# Altium schematic sheet Charger.SchDoc
size A4
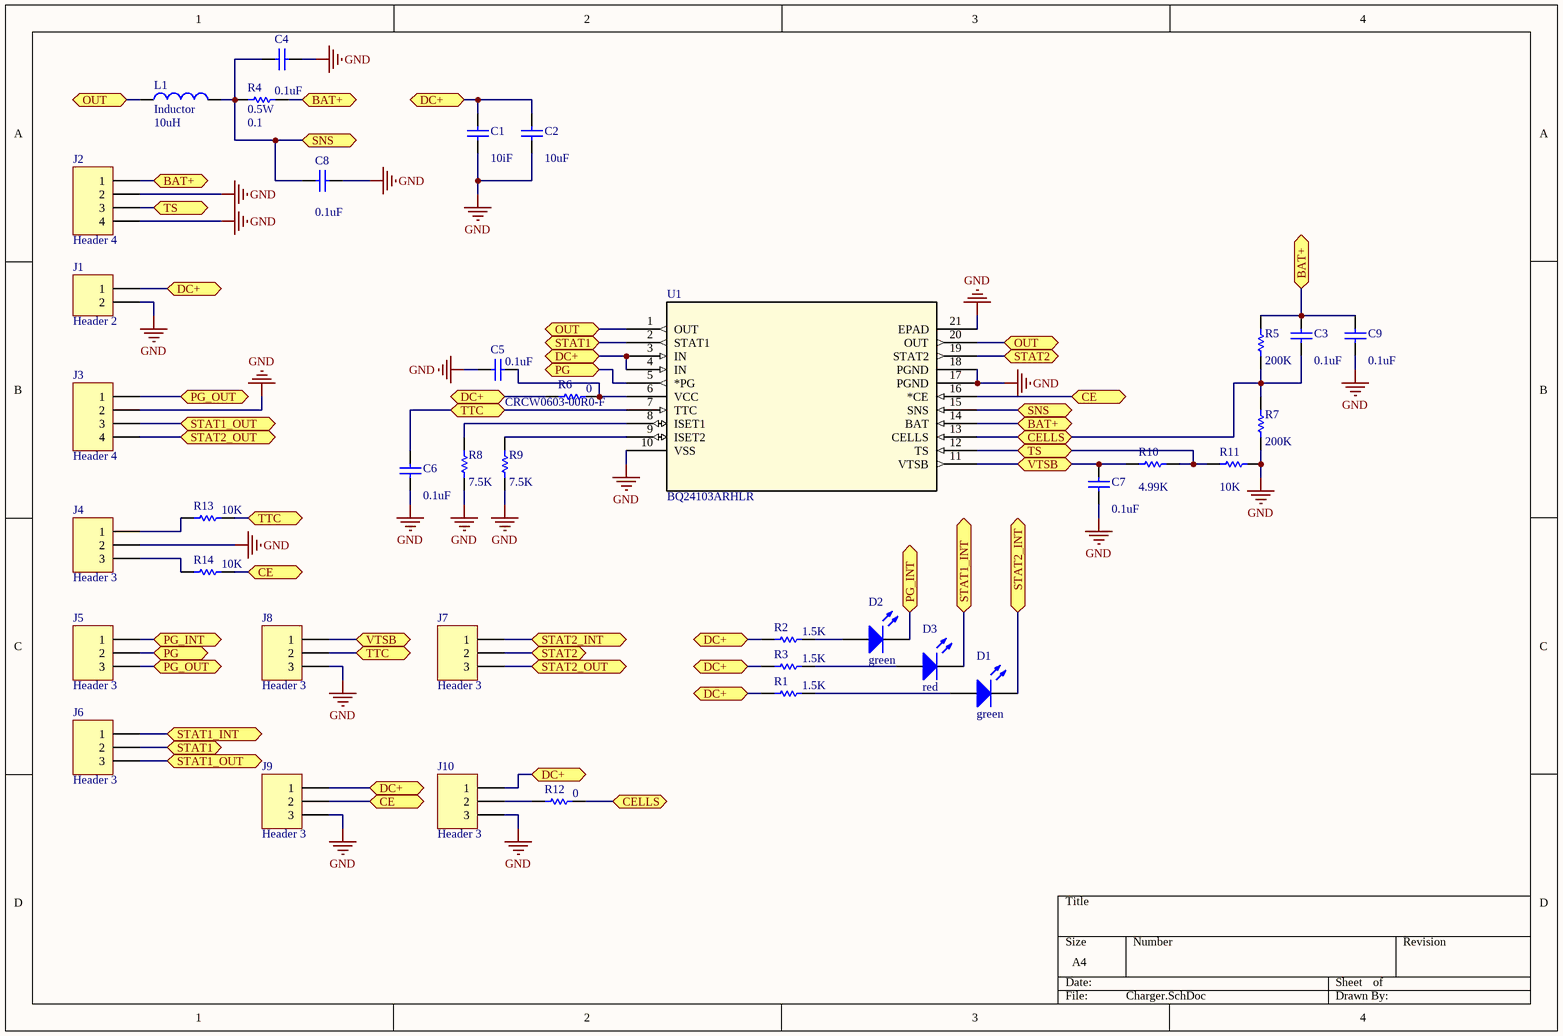
[diagram p0: Charger.SchDoc]

## Parts
C1  value 10iF  [CAPC3216L]
C2  value 10uF  [CAPC3216L]
C3  value 0.1uF  [6-0805_L]
C4  value 0.1uF  [CAPC3216L]
C5  value 0.1uF  [6-0805_L]
C6  value 0.1uF  [6-0805_L]
C7  value 0.1uF  [6-0805_L]
C8  value 0.1uF  [6-0805_L]
C9  value 0.1uF  [CAPC3216L]
D1  green  [6-0805_L]
D2  green  [6-0805_L]
D3  red  [6-0805_L]
J1  Header 2  [691305130002]
J2  Header 4  [691305130004]
J3  Header 4  [691305130004]
J4  Header 3  [691305130003]
J5  Header 3  [HDR1X3]
J6  Header 3  [HDR1X3]
J7  Header 3  [HDR1X3]
J8  Header 3  [HDR1X3]
J9  Header 3  [HDR1X3]
J10  Header 3  [HDR1X3]
L1  Inductor  value 10uH  [IND2926]
R1  value 1.5K  [6-0805_L]
R2  value 1.5K  [6-0805_L]
R3  value 1.5K  [6-0805_L]
R4  0.5W  value 0.1  [12Z-2010]
R5  value 200K  [6-0805_L]
R6  CRCW0603-00R0-F  value 0  [6-0805_L]
R7  value 200K  [6-0805_L]
R8  value 7.5K  [6-0805_L]
R9  value 7.5K  [6-0805_L]
R10  value 4.99K  [6-0805_L]
R11  value 10K  [6-0805_L]
R12  value 0  [6-0805_L]
R13  value 10K  [6-0805_L]
R14  value 10K  [6-0805_L]
U1  BQ24103ARHLR  [RHL20_2P05X3P05]

## Ports
BAT+, CE, CELLS, DC+, OUT, PG, PG_INT, PG_OUT, SNS, STAT1, STAT1_INT, STAT1_OUT, STAT2, STAT2_INT, STAT2_OUT, TS, TTC, VTSB

## Nets
GND: C1.1 C2.1 C4.2 C5.2 C6.2 C7.2 C8.2 C9.2 J1.2 J2.2 J2.4 J3.2 J4.2 J8.3 J9.3 J10.3 R7.2 R8.1 R9.1 R11.1 U1.10(VSS) U1.17(PGND) U1.18(PGND) U1.21(EPAD)
BAT+: C3.1 C9.1 J2.1 R4.2 R5.1 U1.14(BAT) ; port BAT+
CE: J9.2 R14.2 U1.16(*CE) ; port CE
CELLS: C3.2 R5.2 R7.1 R12.2 U1.13(CELLS) ; port CELLS
DC+: C1.2 C2.2 J1.1 J9.1 J10.1 R1.1 R2.1 R3.1 R6.1 U1.3(IN) U1.4(IN) ; port DC+
OUT: L1.1 U1.1(OUT) U1.20(OUT) ; port OUT
PG: J5.2 U1.5(*PG) ; port PG
PG_INT: D2.2(K) J5.1 ; port PG_INT
PG_OUT: J3.1 J5.3 ; port PG_OUT
SNS: C4.1 C8.1 L1.2 R4.1 U1.15(SNS) ; port SNS
STAT1: J6.2 U1.2(STAT1) ; port STAT1
STAT1_INT: D3.2(K) J6.1 ; port STAT1_INT
STAT1_OUT: J3.3 J6.3 ; port STAT1_OUT
STAT2: J7.2 U1.19(STAT2) ; port STAT2
STAT2_INT: D1.2(K) J7.1 ; port STAT2_INT
STAT2_OUT: J3.4 J7.3 ; port STAT2_OUT
TS: J2.3 R10.1 R11.2 U1.12(TS) ; port TS
TTC: C6.1 J8.2 R13.2 U1.7(TTC) ; port TTC
VTSB: C7.1 J8.1 R10.2 U1.11(VTSB) ; port VTSB
NetC5_1: C5.1 R6.2 U1.6(VCC)
NetD1_1: D1.1(A) R1.2
NetD2_1: D2.1(A) R2.2
NetD3_1: D3.1(A) R3.2
NetJ4_1: J4.1 R13.1
NetJ4_3: J4.3 R14.1
NetJ10_2: J10.2 R12.1
NetR8_2: R8.2 U1.8(ISET1)
NetR9_2: R9.2 U1.9(ISET2)

## Library data of the parts
C1-C9 = Cap: Capacitor; Published: 8-Jun-2000; LatestRevisionDate: 17-Jul-2002; LatestRevisionNote: Re-released for DXP Platform.; Publisher: Altium Limited; PackageDescription: Radial Cap, Thru-Hole; 2 Leads; 0.3 in Pin Spacing
  C1 C2 C4 C9: PackageReference: CAPC3216L
  C3 C5-C8: PackageReference: 0603
D1-D3 = LED2: Typical RED, GREEN, YELLOW, AMBER GaAs LED; Published: 8-Jun-2000; LatestRevisionDate: 17-Jul-2002; LatestRevisionNote: Re-released for DXP Platform.; PackageVersion: Feb-2002; PackageReference: 0603; Publisher: Altium Limited; PackageDescription: SM LED; 2 Flat Leads
J1 = Header 2: Header, 2-Pin; LatestRevisionDate: 17-Jul-2002; LatestRevisionNote: Re-released for DXP Platform.; Publisher: Altium Limited
J2 J3 = Header 4: Header, 4-Pin; LatestRevisionDate: 17-Jul-2002; LatestRevisionNote: Re-released for DXP Platform.; Publisher: Altium Limited
J4-J10 = Header 3: Header, 3-Pin; LatestRevisionDate: 17-Jul-2002; LatestRevisionNote: Re-released for DXP Platform.; Publisher: Altium Limited
L1 = Inductor: Code_IEC: 1005; Published: 8-Jun-2000; LatestRevisionDate: 29-May-2009; LatestRevisionNote: IPC-7351 Footprint Added.; PackageReference: 0402-A; Publisher: Altium Limited; PackageDescription: Chip Inductor; Code_JEITA: 0402
R1-R14 = Res1: Resistor; Published: 8-Jun-2000; LatestRevisionDate: 17-Jul-2002; LatestRevisionNote: Re-released for DXP Platform.; Publisher: Altium Limited; PackageDescription: Axial Device, Thru-Hole; 2 Leads; 0.3 in Pin Spacing
  R1-R3 R6 R8-R14: PackageReference: 0603
  R4 R5 R7: PackageReference: AXIAL-0.3
U1 = BQ24103ARHLR: Imported; Manufacturer: Texas Instruments; INDUSTRY_STD_PKG_TYPE: QFN; FAMILY_NAME: BATTERY CHARGE MANAGEMENT; PIN_COUNT: 20; PACKAGE_DESIGNATOR: RHL; 3D_Library_Name: TI_AllParts_2012-12-25; C: Copyright (C) 2015 Accelerated Designs. All rights reserved; Datasheet_URL: http://www.ti.com/lit/gpn/BQ24103A; Copyright: Copyright (C) 2015 Accelerated Designs. All rights reserved; GENERIC_PART_NUMBER: BQ24103A; Manufacturer_Part_Number: BQ24103ARHLR; Vendor: Vendor; Value: Value; Type: Type; RefDes: RefDes